# Altium schematic sheet AC_input.SchDoc
size A4; SheetNumber: 8; SheetTotal: 8
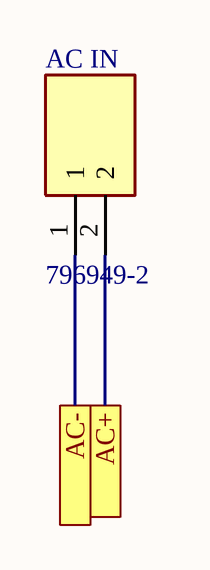
[diagram p0: AC_input.SchDoc]

## Parts
AC_IN  796949-2  [TE_796949-2]

## Ports
AC+ (see GlobalcircuitSchDoc[2B]), AC- (see GlobalcircuitSchDoc[2B])

## Nets
AC+: AC_IN.2 ; port AC+
AC-: AC_IN.1 ; port AC-

## Library data of the parts
AC_IN = 796949-2: Connector Terminal Blocks 2 Position 5.08mm Solder Straight Thru-Hole 17.5A/Contact; MF: TE Connectivity; EU_RoHS_Compliance: Compliant with Exemptions; Price: None; Availability: Unavailable; TE_purchase_URL: https://www.te.com/usa-en/product-796949-2.html?te_bu=Cor&te_type=disp&te_campaign=seda_glo_cor-seda-global-disp-prtnr-fy19-seda-model-bom-cta_sma-317_1&elqCampaignId=32493; Package: None; SnapEDA_Link: https://www.snapeda.com/parts/796949-2/TE%20Connectivity%20AMP%20Connectors/view-part/492230/?ref=snap; MP: 796949-2; Value: *